# Altium schematic sheet PCIe.SchDoc: M.2 PCIe x1 Socket
size A4
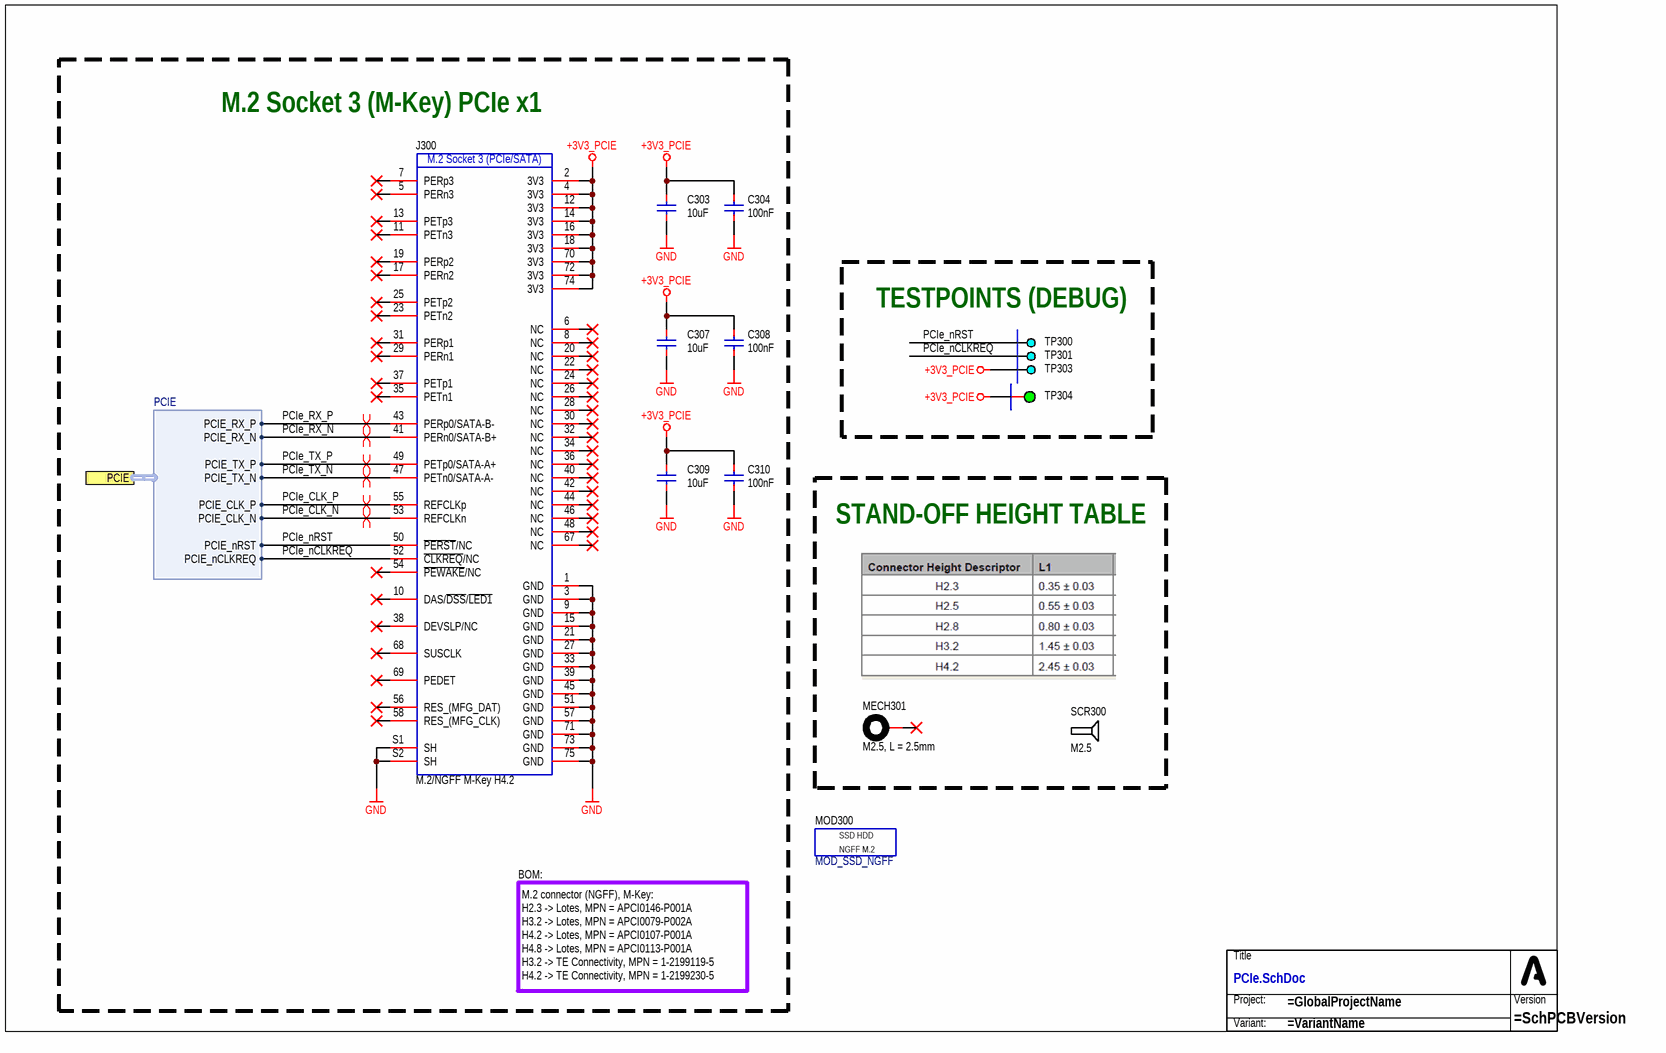
[diagram p0: PCIe.SchDoc]

## Parts
C303  10uF  [CAP_0603_R]
C304  100nF  [CAP_0603_R]
C307  10uF  [CAP_0603_R]
C308  100nF  [CAP_0603_R]
C309  10uF  [CAP_0603_R]
C310  100nF  [CAP_0603_R]
J300  M.2/NGFF M-Key H4.2  [CON_NGFF_KEY-M_P67_H420]
MECH301  M2.5, L = 2.5mm  [PCB_WRT_9774030151]
MOD300  MOD_SSD_NGFF  [MOD_SSD_NGFF_2280_B+M_SAM_EVO850_H300]  (no BOM)
SCR300  M2.5  (mechanical)
TB?  (no value)  (no BOM)
TP300  DEBUG  [PCB_TP_DBG_50]  (value not drawn)  (no BOM)
TP301  DEBUG  [PCB_TP_DBG_50]  (value not drawn)  (no BOM)
TP303  DEBUG  [PCB_TP_DBG_50]  (value not drawn)  (no BOM)
TP304  ICT  [PCB_TP_ICT_100]  (value not drawn)  (no BOM)

## Ports
PCIE (harness PCIE)

## Harnesses
PCIE: PCIE_TX_P, PCIE_TX_N, PCIE_RX_P, PCIE_RX_N, PCIE_CLK_P, PCIE_CLK_N, PCIE_nCLKREQ, PCIE_nRST

## Nets
+3V3_PCIE: C303.2 C304.2 C307.2 C308.2 C309.2 C310.2 J300.2(3V3) J300.4(3V3) J300.12(3V3) J300.14(3V3) J300.16(3V3) J300.18(3V3) J300.70(3V3) J300.72(3V3) J300.74(3V3) TP303.1 TP304.1
GND: C303.1 C304.1 C307.1 C308.1 C309.1 C310.1 J300.1(GND) J300.3(GND) J300.9(GND) J300.15(GND) J300.21(GND) J300.27(GND) J300.33(GND) J300.39(GND) J300.45(GND) J300.51(GND) J300.57(GND) J300.71(GND) J300.73(GND) J300.75(GND) J300.S1(SH) J300.S2(SH)
PCIe_CLK_N: J300.53(REFCLKn) ; port PCIE.PCIE_CLK_N
PCIe_CLK_P: J300.55(REFCLKp) ; port PCIE.PCIE_CLK_P
PCIe_nCLKREQ: J300.52(~{CLKREQ}/NC) TP301.1 ; port PCIE.PCIE_nCLKREQ
PCIe_nRST: J300.50(~{PERST}/NC) TP300.1 ; port PCIE.PCIE_nRST
PCIe_RX_N: J300.41(PERn0/SATA-B+) ; port PCIE.PCIE_RX_N
PCIe_RX_P: J300.43(PERp0/SATA-B-) ; port PCIE.PCIE_RX_P
PCIe_TX_N: J300.47(PETn0/SATA-A-) ; port PCIE.PCIE_TX_N
PCIe_TX_P: J300.49(PETp0/SATA-A+) ; port PCIE.PCIE_TX_P

Not connected (* = marked no-connect by the designer): J300 5(PERn3)* 6(NC)* 7(PERp3)* 8(NC)* 10(DAS/~{DSS}/~{LED1})* 11(PETn3)* 13(PETp3)* 17(PERn2)* 19(PERp2)* 20(NC)* 22(NC)* 23(PETn2)* 24(NC)* 25(PETp2)* 26(NC)* 28(NC)* 29(PERn1)* 30(NC)* 31(PERp1)* 32(NC)* 34(NC)* 35(PETn1)* 36(NC)* 37(PETp1)* 38(DEVSLP/NC)* 40(NC)* 42(NC)* 44(NC)* 46(NC)* 48(NC)* 54(~{PEWAKE}/NC)* 56(RES_(MFG_DAT))* 58(RES_(MFG_CLK))* 67(NC)* 68(SUSCLK)* 69(PEDET)*; MECH301 1*

## Layout directives
differential pair: PCIe_CLK_N, PCIe_CLK_P, PCIe_RX_N, PCIe_RX_P, PCIe_TX_N, PCIe_TX_P

## Notes on the sheet
- M.2 Socket 3 (M-Key) PCIe x1
- TESTPOINTS (DEBUG)
- STAND-OFF HEIGHT TABLE
- BOM:
- M.2 connector (NGFF), M-Key:
  H2.3 -> Lotes, MPN = APCI0146-P001A
  H3.2 -> Lotes, MPN = APCI0079-P002A
  H4.2 -> Lotes, MPN = APCI0107-P001A
  H4.8 -> Lotes, MPN = APCI0113-P001A
  H3.2 -> TE Connectivity, MPN = 1-2199119-5
  H4.2 -> TE Connectivity, MPN = 1-2199230-5
- (in symbol CON_NGFF_M-KEY_A2) M.2 Socket 3 (PCIe/SATA)
- (in symbol MOD_SSD_NGFF) SSD HDD; NGFF M.2
- (in symbol SCH_TITLE_BLOCK_SIMPLE_NODATE) Title; Project:; Version; Variant:

## Library data of the parts
C303 C307 C309 = CAP-0023: CAP SMD 10u/10V ±10% 10V X5R (0603); Manufacturer: Samsung Electro-Mechanics; MPN: CL10A106KP8NNNC; Component Subtype: MLCC; Package (Case): 0603; Component Type: Capacitor; Value: 10uF; Mounting Type: SMD
C304 C308 C310 = CAP-0008: Capacitor; MLCC; 100nF; 10V X5R; Manufacturer: YAGEO; MPN: CC0603KRX7R9BB104; Package (Case): 0603; Component Type: Capacitor; Component Subtype: MLCC; Value: 100nF; Mounting Type: SMD
J300 = CON_NGFF_M-KEY_A2: Connector; NGFF (M.2); M-Key;; Manufacturer: Lotes; MPN: APCI0107-P001A; Component Subtype: M.2 Socket (M-Key); Package (Case): SMD; Component Type: Connector; Mounting Type: SMD; Value: M.2/NGFF M-Key H4.2
MECH301 = PCB_MECH_WRT_WA-SMSI: PCB; Mechanical; SMT Steel Spacer; M2.5;; Manufacturer: Wurth Elektronik; MPN: 977 402 515 1; Component Subtype: SMD Spacer; Package (Case): SMD; Value: M2.5, L = 2.5mm; Component Type: Spacer (Standoff); Mounting Type: SMD
MOD300 = MOD_SSD_NGFF: Module; SSD Disk; NGFF M.2;; Component Type: M.2 Module (NGFF)
SCR300 = PCB_MECH_SCR: Mechnical; Screw;; MPN: M2.5 screw; Value: M2.5
TB? = SCH_TITLE_BLOCK_SIMPLE_NODATE
TP300 TP301 TP303 = PCB_TP_DBG: PCB Marking; Test Point (Debug);; Value: DEBUG; Component Type: Testpoint
TP304 = PCB_TP_ICT: Test Point (ICT); Component Type: Testpoint (for ICT); Mounting Type: Non component; Value: ICT